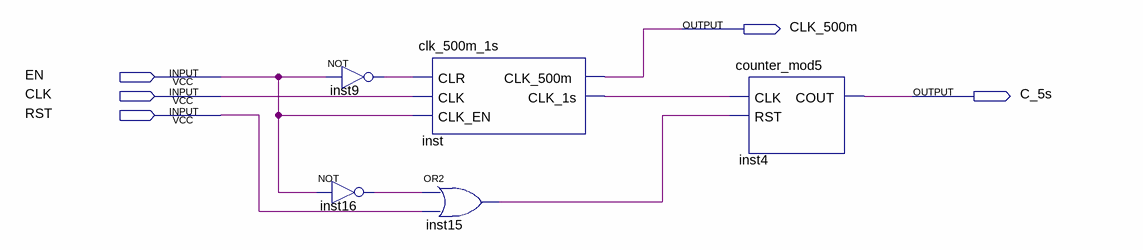
[diagram p0: schematic sheet]
// Quartus schematic timer_500m_5s.bdf as structural Verilog: 5 symbols, 5 pins
module timer_500m_5s (
  input  EN,
  input  CLK,
  input  RST,
  output CLK_500m,
  output C_5s
);

  wire inst9_out, inst15_out, inst16_out, inst_clk_1s;

  not inst9 (inst9_out, EN);
  not inst16 (inst16_out, EN);
  clk_500m_1s inst (.CLR(inst9_out), .CLK(CLK), .CLK_EN(EN), .CLK_500m(CLK_500m), .CLK_1s(inst_clk_1s));
  or inst15 (inst15_out, inst16_out, RST);
  counter_mod5 inst4 (.CLK(inst_clk_1s), .RST(inst15_out), .COUT(C_5s));
endmodule
